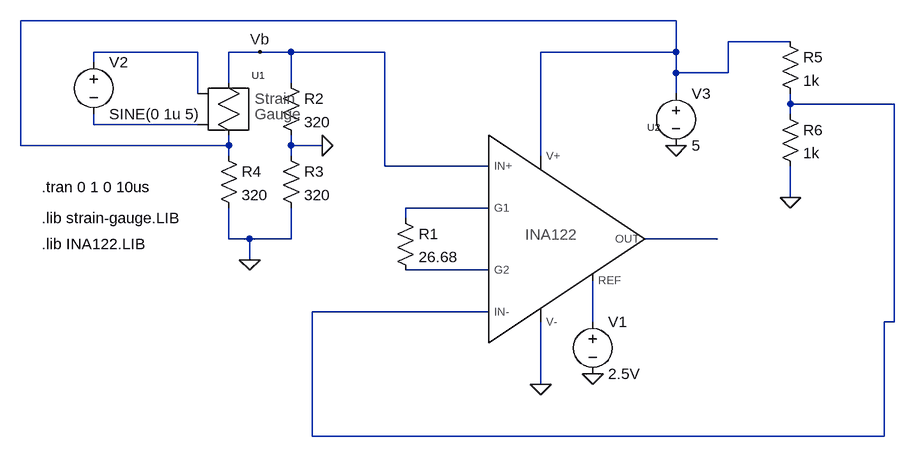
[diagram p0: schematic T5_6_sg_opamp.asc]
T5_6_sg_opamp.asc, the LTspice schematic file:
Version 4
SHEET 1 964 680
WIRE 624 -32 -384 -32
WIRE 800 0 704 0
WIRE -112 16 -272 16
WIRE -16 16 -64 16
WIRE 32 16 -16 16
WIRE 176 16 32 16
WIRE 624 16 624 -32
WIRE 624 16 416 16
WIRE -272 32 -272 16
WIRE 624 48 624 16
WIRE 704 48 704 0
WIRE 704 48 624 48
WIRE -64 64 -64 16
WIRE 32 64 32 16
WIRE -112 80 -112 16
WIRE 624 80 624 48
WIRE 800 96 800 80
WIRE 960 96 800 96
WIRE 800 112 800 96
WIRE -272 128 -272 112
WIRE -112 128 -272 128
WIRE -384 160 -384 -32
WIRE -64 160 -64 144
WIRE -64 160 -384 160
WIRE 32 160 32 144
WIRE 80 160 32 160
WIRE -64 176 -64 160
WIRE 32 176 32 160
WIRE 416 176 416 16
WIRE 176 192 176 16
WIRE 336 192 176 192
WIRE 800 240 800 192
WIRE 336 256 208 256
WIRE 208 272 208 256
WIRE -64 304 -64 256
WIRE -32 304 -64 304
WIRE 32 304 32 256
WIRE 32 304 -32 304
WIRE 688 304 576 304
WIRE -32 336 -32 304
WIRE 336 352 208 352
WIRE 336 416 64 416
WIRE 496 432 496 368
WIRE 960 432 960 96
WIRE 960 432 944 432
WIRE 416 528 416 432
WIRE 64 608 64 416
WIRE 944 608 944 432
WIRE 944 608 64 608
FLAG -32 336 0
FLAG -16 16 Vb
FLAG 624 160 0
FLAG 416 528 0
FLAG 80 160 0
FLAG 800 240 0
FLAG 496 512 0
SYMBOL res 16 48 R0
SYMATTR InstName R2
SYMATTR Value 320
SYMBOL res 16 160 R0
SYMATTR InstName R3
SYMATTR Value 320
SYMBOL res -80 160 R0
SYMATTR InstName R4
SYMATTR Value 320
SYMBOL strain-gauge -80 48 R0
SYMATTR SpiceLine R=320 L=0.32 k=1.76 n=32
SYMATTR InstName U1
SYMBOL voltage -272 16 R0
WINDOW 123 0 0 Left 0
WINDOW 39 0 0 Left 0
SYMATTR InstName V2
SYMATTR Value SINE(0 1u 5)
SYMBOL INA122 320 256 R0
SYMATTR InstName U2
SYMBOL voltage 624 64 R0
WINDOW 123 0 0 Left 0
WINDOW 39 0 0 Left 0
SYMATTR InstName V3
SYMATTR Value 5
SYMBOL res 192 256 R0
SYMATTR InstName R1
SYMATTR Value 26.68
SYMBOL res 784 -16 R0
SYMATTR InstName R5
SYMATTR Value 1k
SYMBOL res 784 96 R0
SYMATTR InstName R6
SYMATTR Value 1k
SYMBOL voltage 496 416 R0
WINDOW 123 0 0 Left 0
WINDOW 39 0 0 Left 0
SYMATTR InstName V1
SYMATTR Value 2.5V
TEXT -352 272 Left 2 !.lib strain-gauge.LIB
TEXT -352 224 Left 2 !.tran 0 1 0 10us
TEXT -352 312 Left 2 !.lib INA122.LIB

The netlist it stands for:
* T5_6_sg_opamp.asc
R2 Vb 0 320
R3 0 0 320
R4 N001 0 320
XU1 Vb N001 N002 N004 strain-gauge R=320 L=0.32 k=1.76 n=32  ; pins 1 2 3 4
V2 N002 N004 SINE(0 1u 5)
XU2 Vb N003 N008 N001 0 N005 N007 N006 INA122  ; pins IN+ IN- REF V+ V- G1 G2 OUT
V3 N001 0 5
R1 N005 N007 26.68
R5 N001 N003 1k
R6 N003 0 1k
V1 N008 0 2.5V
.lib strain-gauge.LIB
.tran 0 1 0 10us
.lib INA122.LIB
.lib strain-gauge.LIB
.lib INA122.LIB
.backanno
.end